# Altium schematic sheet ShutdownSegement.SchDoc: QUTMS_Shutdown_V2_1
size A4; DocumentNumber: 10; SheetNumber: 10; SheetTotal: 10
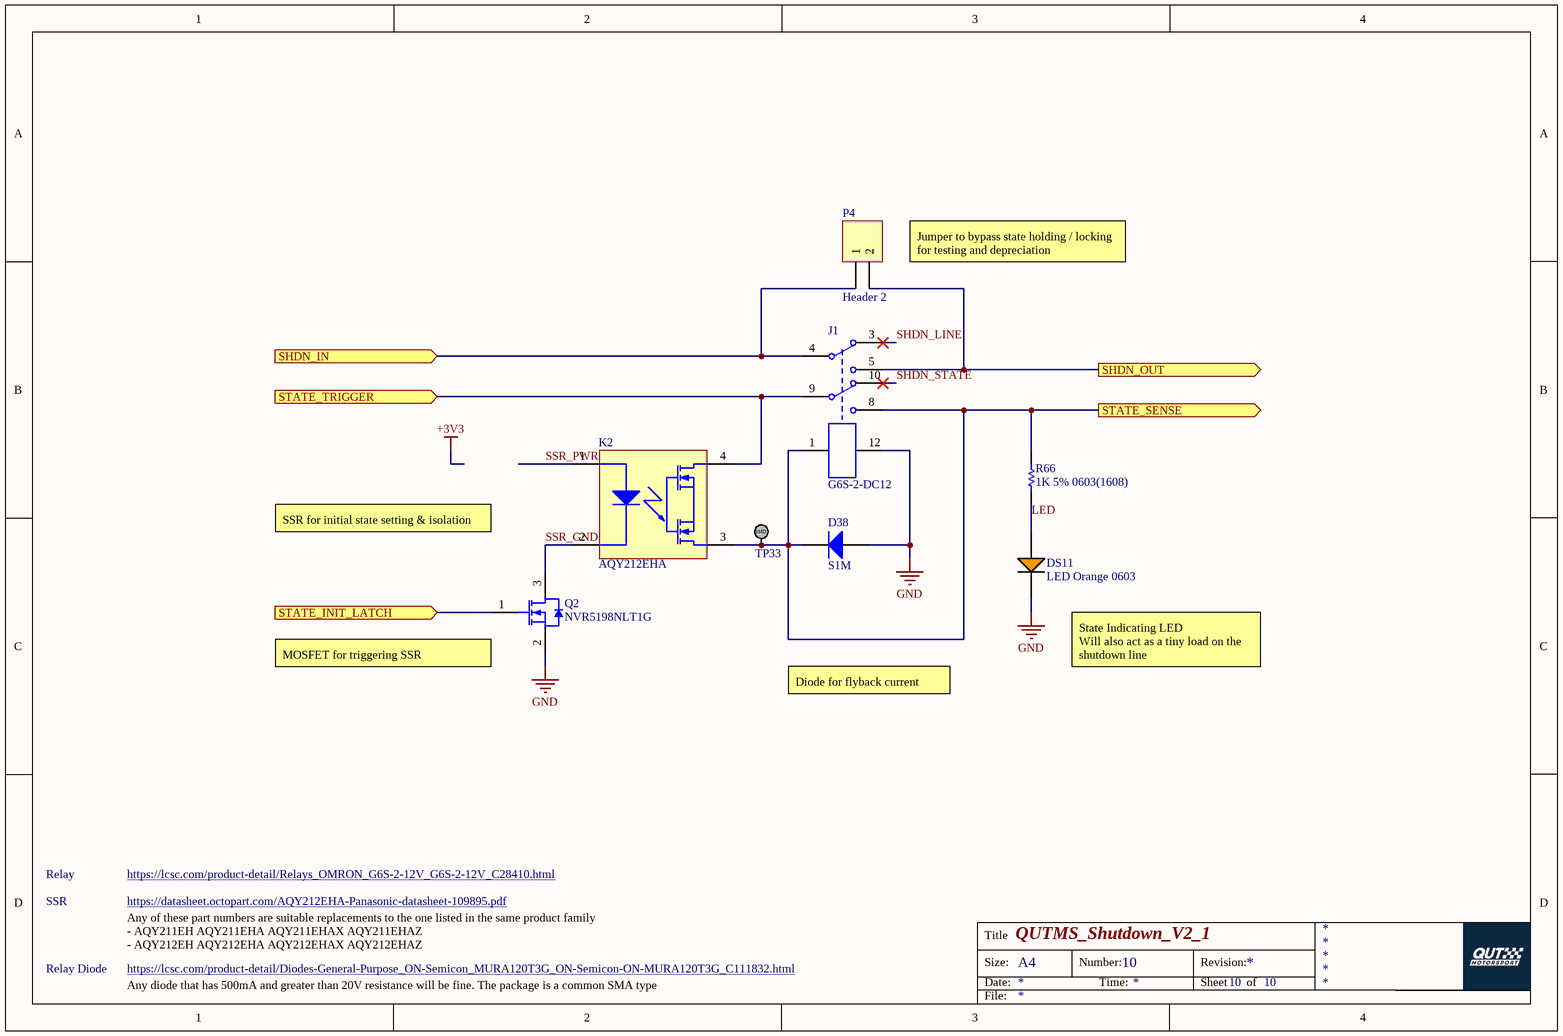
[diagram p0: ShutdownSegement.SchDoc]

## Parts
D38  S1M  [FAIR-DO-214AC-2_V]
DS11  LED Orange 0603  [LED ORANGE 0603]
J1  G6S-2-DC12  [G6S-2]
K2  AQY212EHA  [PNSC-DIP4(SMT)_V]
P4  Header 2  [HDR1X2]
Q2  NVR5198NLT1G  [ONSC-SOT-23-3-318-08_V]
R66  1K 5% 0603(1608)  [RESC0603(1608)_L]
TP33  TestPoint_SMD  [TestPointSMD]  (value not drawn)

## Ports
SHDN_IN (in), SHDN_OUT (out), STATE_INIT_LATCH (in), STATE_SENSE (out), STATE_TRIGGER (in)

## Nets
GND: D38.1(A) DS11.2(C) J1.12 Q2.2(S)
LED: DS11.1(A) R66.1
SHDN_IN: J1.4 P4.1 ; port SHDN_IN
SHDN_LINE: J1.3
SHDN_OUT: J1.5 P4.2 ; port SHDN_OUT
SHDN_STATE: J1.10
SSR_GND: K2.2 Q2.3(D)
SSR_PWR: K2.1
STATE_INIT_LATCH: Q2.1(G) ; port STATE_INIT_LATCH
STATE_SENSE: D38.2(K) J1.1 J1.8 K2.3 R66.2 TP33.1 ; port STATE_SENSE
STATE_TRIGGER: J1.9 K2.4 ; port STATE_TRIGGER

## Notes on the sheet
- (near P4) Jumper to bypass state holding / locking for testing and depreciation
- SSR for initial state setting & isolation
- (near Q2) MOSFET for triggering SSR
- Diode for flyback current
- State Indicating LED
  Will also act as a tiny load on the shutdown line
- SSR
- Relay
- https://datasheet.octopart.com/AQY212EHA-Panasonic-datasheet-109895.pdf
- https://lcsc.com/product-detail/Relays_OMRON_G6S-2-12V_G6S-2-12V_C28410.html
- Relay Diode
- Any of these part numbers are suitable replacements to the one listed in the same product family
  - AQY211EH AQY211EHA AQY211EHAX AQY211EHAZ
  - AQY212EH AQY212EHA AQY212EHAX AQY212EHAZ
- https://lcsc.com/product-detail/Diodes-General-Purpose_ON-Semicon_MURA120T3G_ON-Semicon-ON-MURA120T3G_C111832.html
- Any diode that has 500mA and greater than 20V resistance will be fine. The package is a common SMA type
- Title
- Size:
- Date:
- A4
- Number:
- Time:
- Revision:
- Sheet
- of
- File:
- (in symbol TestPoint_SMD) SMD

## Library data of the parts
D38 = CMP-2000-04942-2: General Purpose Rectifier, 1 A, 1000 V, -55 to 150 degC, 2-Pin DO-214AC, RoHS, Tape and Reel; Manufacturer: Fairchild; Repetitive Reverse Voltage Vrrm Max: 1kV; Reel Quantity: 7500; Forward Voltage: 1V; No. of Pins: 2; External Depth: 2.79mm; Current Ifsm: 30A; Diode Configuration: Single; Reverse Recovery Time trr Max: 1.8µs; Diode Type: StandardRecovery; External Width: 5.28mm; SVHC: NoSVHC(19-Dec-2012); External Length / Height: 2.44mm; Diode Polarity: Cathode; Current If @ Vf: 1A; SMD Marking: 1M; Tape Width: 12mm; Datasheet URL: https://datasheet.ciiva.com/4452/s1m-191340-4452980.pdf; Alternate Case Style: DO-214AC; Package Reference: DO-214AC-2; Diode Case Style: DO-214AC; Package / Case: SMA; Junction Temperature Tj Max: 150degC; Operating Temperature Range: -55degCto+150degC; Operating Temperature Min: -55degC; Datasheet Version: Rev. 1.1.2, 10/2013; Manufacturer URL: https://www.fairchildsemi.com/; Termination Type: SMD; Forward Surge Current Ifsm Max: 30A; Operating Temperature Max: 150degC; Package Description: 2-Pin Surface Mount Device, Body 4.375 x 2.725 mm; Package URL: https://www.fairchildsemi.com/package-drawings/DO/DO214AC.pdf; Reverse Recovery Time trr Typ: 1.8µs; Forward Voltage VF Max: 1V; Forward Current If(AV): 1A
J1 = G6S-2-DC12: Telecom Non Latching 12VDC DPDT 2A Through Hole Relays RoHS; ComponentLink1Description: LCSC; ComponentLink1URL: https://lcsc.com/product-detail/Relays_OMRON_G6S-2-12V_G6S-2-12V_C28410.html
K2 = CMP-1346-00006-1: PhotoMOS GE 1 Form A, 60 V Load Voltage, 0.55 A Continuous Load Current, -40 to 85 degC, 4-Pin DIP(SMT), Tube, RoHS; Manufacturer: Panasonic; Continuous Load Current: 0.55 A; Load Voltage: 60 V; On Resistance (Typ): 0.85 Ohm; Pb-Free: True; ComponentLink2Description: Datasheet; PackageVersion: ASCTB67E, 04/2014; DatasheetVersion: 201404-T; Packing: Tube; ComponentLink1URL: http://www3.panasonic.biz/ac/ae/index.jsp; PackageReference: DIP4(SMT); Series: PhotoMOS GE 1 Form A; RoHS: True; ComponentLink1Description: Manufacturer URL; ComponentLink3Description: Package Specification; PartNumber: AQY212EHA; PackageDescription: 4-Pin Surface Mount Terminal Package, Body 4.78 x 6.4 mm, Pitch 2.54mm; ComponentLink2URL: http://www3.panasonic.biz/ac/e_download/control/relay/photomos/catalog/semi_eng_ge1a_aqy21_e.pdf; ComponentLink3URL: http://www3.panasonic.biz/ac/e_download/control/relay/photomos/catalog/semi_eng_dimensions.pdf?f_cd=401560; Mounting Technology: Surface Mount
P4 = Header 2: Header, 2-Pin; LatestRevisionDate: 17-Jul-2002; LatestRevisionNote: Re-released for DXP Platform.; Publisher: Altium Limited
Q2 = CMP-1058-00774-1: Power MOSFET, 60 V, 155 mOhm, Single N-Channel Logic Level, 3-Pin SOT-23, Pb-Free, Tape and Reel; Manufacturer: On Semiconductor; Ciss Typ (pF): 182; Coss Typ (pF): 25; ID Max (A): 2.2; Crss Typ (pF): 16; V(BR)DSS Min (V): 60; Qrr Typ (nC): 6; VGS Max (V): 20; VGS(th) Max (V): 2.5; Channel Polarity: N Channel; Package Type: SOT-23-3; ComponentLink1URL: http://www.onsemi.com/; ComponentLink2Description: Datasheet; ComponentLink1Description: Manufacturer URL; Mounting Technology: Surface Mount; Configuration: Single; Packing: Tape and Reel; RoHS: Pb-Free; ComponentLink3URL: http://www.onsemi.cn/pub_link/Collateral/318-08.PDF; PackageVersion: Rev. AP, 11/2009; PackageReference: SOT-23-3-318-08; DatasheetVersion: Rev. 1; PackageDescription: 3-Pin Small Outline Transistor, Body 2.92 x 1.3 mm, Pitch 0.95 mm; ComponentLink3Description: Package Specification; ComponentLink2URL: http://www.onsemi.com/pub_link/Collateral/NVR5198NL-D.PDF; PartNumber: NVR5198NLT1G
R66 = CMP-1012-00074-1: 1K 0.1W 5% 0603 (1608 Metric)  SMD; Case-EIA: 0603; Case-Metric: 1608; Value: 1000.00 Ohm; Technology: SMT; Tolerance: 5 %; Power: 0.1 W